# EAGLE schematic Design (EAGLE 9.3.1)
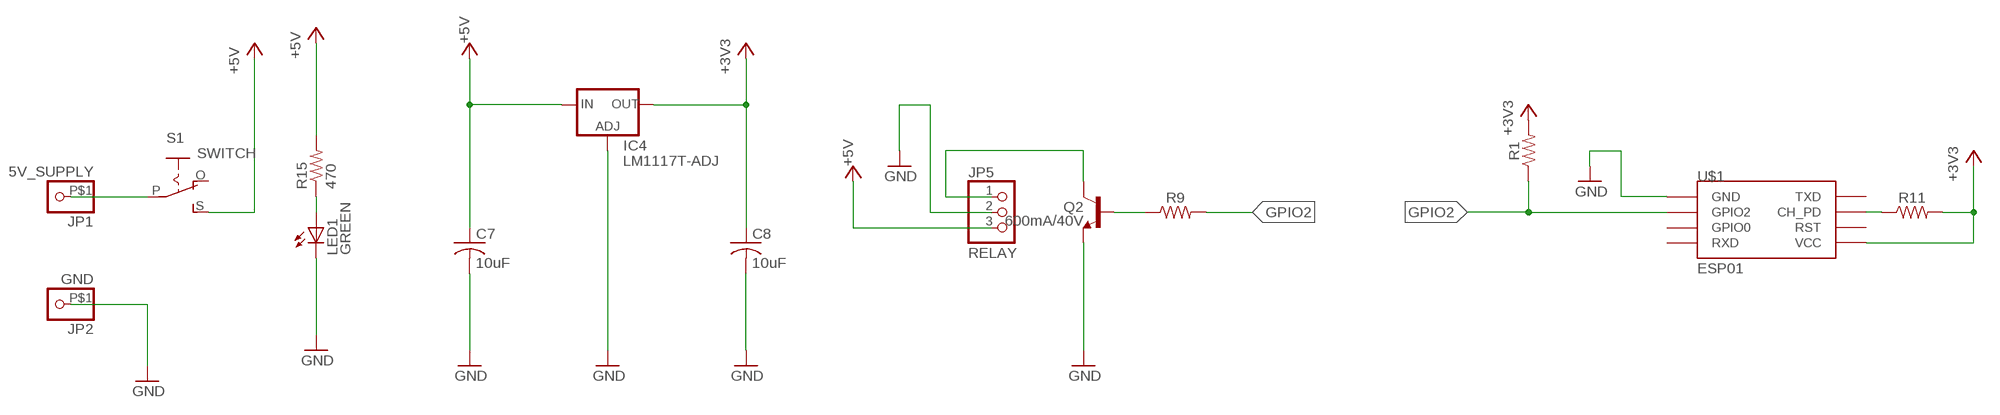
[diagram p0: schematic, sheet 1]

## Parts
C7  10uF  C-US025-025X050  [C025-025X050]
C8  10uF  C-US025-025X050  [C025-025X050]
IC4  LM1117T-ADJ  [TO220]
JP1  5V_SUPPLY  PINHD-1X1-BIGPOGO  [1X1-BIGPOGO]
JP2  GND  PINHD-1X1-BIGPOGO  [1X1-BIGPOGO]
JP5  RELAY  PINHD-1X3  [1X03]
LED1  GREEN  LED5MM  [LED5MM]
Q2  600mA/40V  TRANS_NPN-P2N2222A  [TO-92]
R1  10k  R-US_0207/12  [0207/12]
R9  4.7k  R-US_0207/12  [0207/12]
R11  10k  R-US_0207/12  [0207/12]
R15  470  R-US_0207/12  [0207/12]
S1  SWITCH  EG1218S  [EG1218]
U$1  ESP01  [ESP01]

## Nets
+3V3: C8.1 IC4.2(OUT) R1.2 R11.2 U$1.VCC
+5V: C7.1 IC4.3(IN) JP5.3 R15.2 S1.S
GND: C7.2 C8.2 IC4.1(ADJ) JP2.P$1 JP5.2 LED1.K(C) Q2.3(E) U$1.GND
GPIO2: R1.1 R9.2 U$1.GPIO2
N$1: JP1.P$1 S1.P
N$3: R11.1 U$1.CH_PD
N$12: JP5.1 Q2.1(C)
N$13: Q2.2(B) R9.1
N$19: LED1.A R15.1
Unconnected: S1.O U$1.GPIO0 U$1.RST U$1.RX(RXD) U$1.TX(TXD)

## Library data of the parts
C7 C8 = adafruit:C-US: CAPACITOR, American symbol
IC4 = lm1117:LM1117T-ADJ
JP1 JP2 = adafruit:PINHD-1X1: Pin header 1x1 for 0.1" spacing With round pins
JP5 = pinhead:PINHD-1X3: PIN HEADER
LED1 = adafruit:LED: LED OSRAM: - CHIPLED LG R971, LG N971, LY N971, LG Q971, LY Q971, LO R971, LY R971 LH N974, LH R974 LS Q976, LO Q976, LY Q976 LO Q996 - Hyper CHIPLED LW Q18S LB Q993, LB Q99A, LB R99A - SideLED LS A670, LO A670, LY A670, LG A670, LP A670 LB A673, LV A673, LT A673, LW A673 LH A674 LY A675 LS A676, LA A676, LO A676, LY A676, LW A676 LS A679, LY A679, LG A679 - Hyper Micro SIDELED® LS Y876, LA Y876, LO Y876, LY Y876 LT Y87S - SmartLED LW L88C, LW L88S LB L89C, LB L89S, LG L890 LS L89K, LO L89K, LY L89K LS L896, LA L896, LO L896, LY L896 - TOPLED LS T670, LO T670, LY T670, LG T670, LP T670 LSG T670, LSP T670, LSY T670, LOP T670, LYG T670 LG T671, LOG T671, LSG T671 LB T673, LV T673, LT T673, LW T673 LH T674 LS T676, LA T676, LO T676, LY T676, LB T676, LH T676, LSB T676, LW T676 LB T67C, LV T67C, LT T67C, LS T67K, LO T67K, LY T67K, LW E67C LS E67B, LA E67B, LO E67B, LY E67B, LB E67C, LV E67C, LT E67C LW T67C LS T679, LY T679, LG T679 LS T770, LO T770, LY T770, LG T770, LP T770 LB T773, LV T773, LT T773, LW T773 LH T774 LS E675, LA E675, LY E675, LS T675 LS T776, LA T776, LO T776, LY T776, LB T776 LHGB T686 LT T68C, LB T68C - Hyper Mini TOPLED® LB M676 - Mini TOPLED Santana® LG M470 LS M47K, LO M47K, LY M47K Source: http://www.osram.convergy.de/
Q2 = SparkFun-DiscreteSemi:TRANS_NPN: NPN transistor Current controlled devices typically used to amplify current or used as a switch. BC547 - COM-08928 <http://www.sparkfun.com/products/8928> (TO-92 45V 100mA) (1.Collector 2.Base 3.Emitter) 2N3904 - COM-00521 <http://www.sparkfun.com/products/521> (TO-92 40V 200mA) (1.Emitter 2.Base 3.Collector) P2N2222A - COM-12852 <http://www.sparkfun.com/products/12852> (TO-92 40V 600mA) (1.Collector 2.Base 3.Emitter); PROD_ID: TRANS-09536
R1 R9 R11 R15 = adafruit:R-US_: RESISTOR, American symbol
S1 = adafruit:EG1218: SLIDING SWITCH 0.1" spacing through hole, vertical SPDT slide switch http://www.ladyada.net/library/pcb/eaglelibrary.html
U$1 = esp8266modules:ESP01: ESP8266 Wifi module 01